# Altium schematic sheet Sheet2.SchDoc
size A4
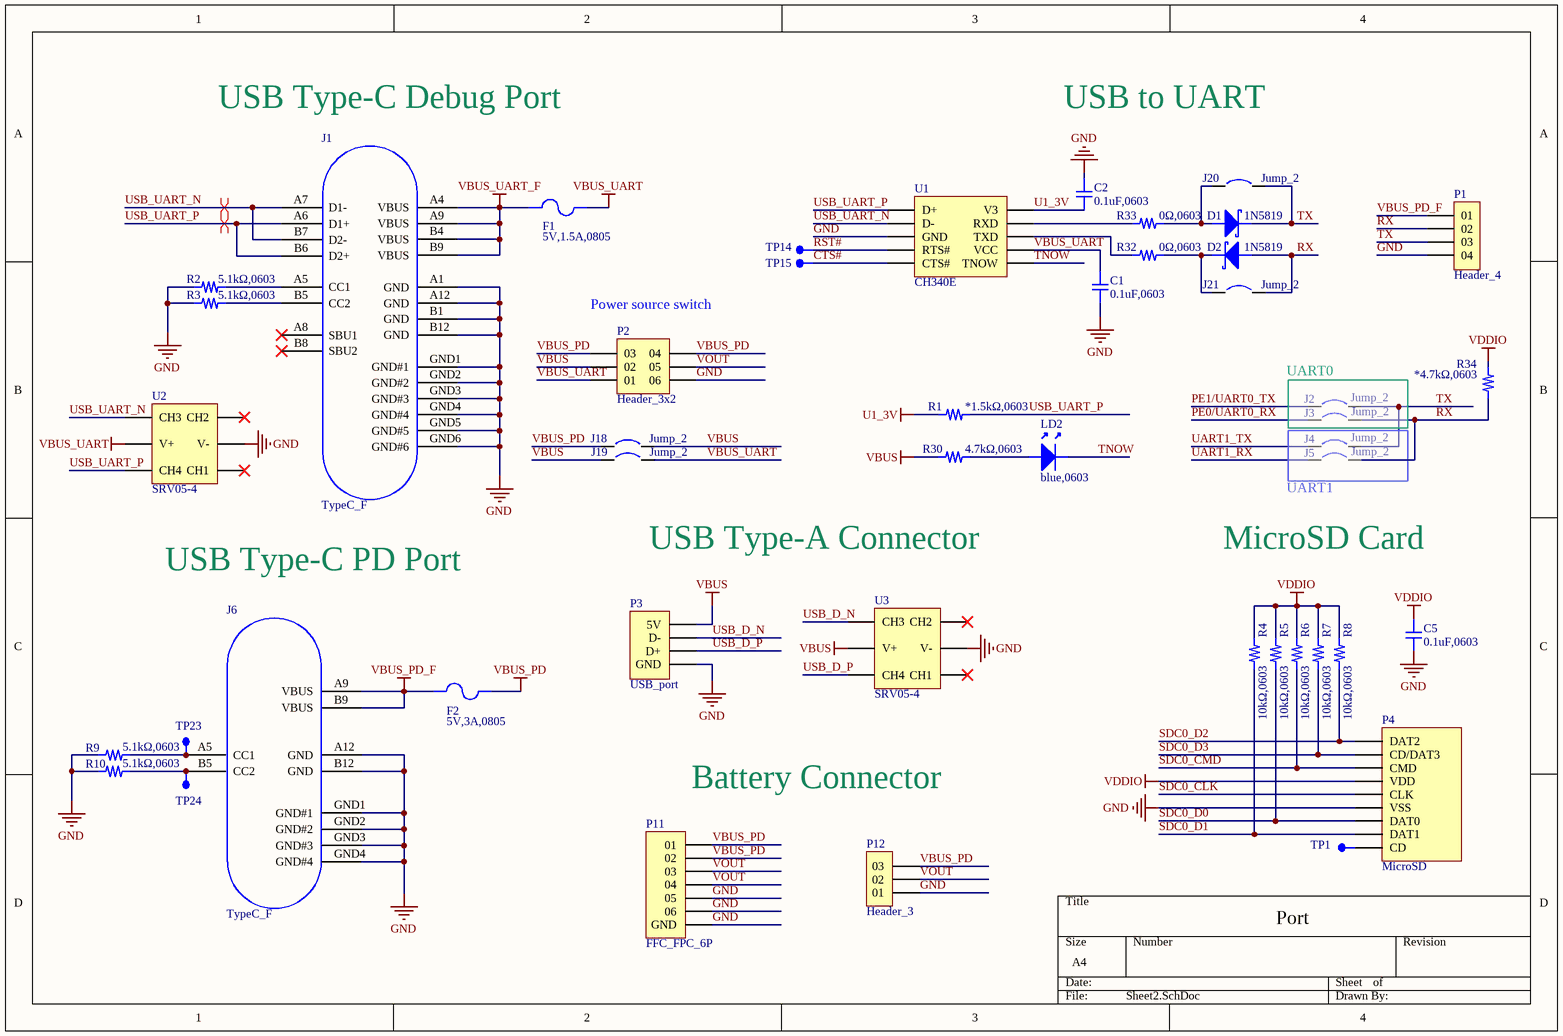
[diagram p0: Sheet2.SchDoc]

## Parts
C1  0.1uF,0603  [C0603]
C2  0.1uF,0603  [C0603]
C5  0.1uF,0603  [C0603]
D1  1N5819  [SOD-323]
D2  1N5819  [SOD-323]
F1  5V,1.5A,0805  [F0805]
F2  5V,3A,0805  [F0805]
J1  TypeC_F  [Type-C_16P_F_0.5_BOTH]
J2  Jump_2  [Jp_small]
J3  Jump_2  [Jp_small]
J4  Jump_2  [Jp_small]
J5  Jump_2  [Jp_small]
J6  TypeC_F  [Type-C_6P_F_BOTH]
J18  Jump_2  [Jp_small]
J19  Jump_2  [Jp_small]
J20  Jump_2  [Jp_small]
J21  Jump_2  [Jp_small]
LD2  blue,0603  [LED0603]
P1  Header_4  [Header_4]
P2  Header_3x2  [HEADER_3x2]
P3  USB_port  [USB-A-female-90]
P4  MicroSD  [MicroSD]
P11  FFC_FPC_6P  [FPC_1MM_6P]
P12  Header_3  [HEADER_3_2MM_SMD]
R1  *1.5kΩ,0603  [R0603]
R2  5.1kΩ,0603  [R0603]
R3  5.1kΩ,0603  [R0603]
R4  10kΩ,0603  [R0603]
R5  10kΩ,0603  [R0603]
R6  10kΩ,0603  [R0603]
R7  10kΩ,0603  [R0603]
R8  10kΩ,0603  [R0603]
R9  5.1kΩ,0603  [R0603]
R10  5.1kΩ,0603  [R0603]
R30  4.7kΩ,0603  [R0603]
R32  0Ω,0603  [R0603]
R33  0Ω,0603  [R0603]
R34  *4.7kΩ,0603  [R0603]
TP1  TP  [TP]  (value not drawn)
TP14  TP  [TP]  (value not drawn)
TP15  TP  [TP]  (value not drawn)
TP23  TP  [TP]  (value not drawn)
TP24  TP  [TP]  (value not drawn)
U1  CH340E  [MSOP-10]
U2  SRV05-4  [SOT23-6]
U3  SRV05-4  [SOT23-6]

## Blocks framed on the sheet
UART0: J2 J3

## Nets
GND: C1.02 C2.01 C5.01 J1.A1(GND) J1.A12(GND) J1.B1(GND) J1.B12(GND) J1.GND1(GND#1) J1.GND2(GND#2) J1.GND3(GND#3) J1.GND4(GND#4) J1.GND5(GND#5) J1.GND6(GND#6) J6.A12(GND) J6.B12(GND) J6.GND1(GND#1) J6.GND2(GND#2) J6.GND3(GND#3) J6.GND4(GND#4) P1.04 P2.06 P3.01(GND) P4.06(VSS) P11.0(GND) P11.05 P11.06 P12.01 R2.01 R3.01 R9.01 R10.01 U1.03(GND) U2.02(V-) U3.02(V-)
U1_3V: C2.02 R1.02 U1.10(V3)
VBUS: J18.02 J19.01 P2.02 P3.04(5V) R30.01 U3.05(V+)
VBUS_PD: F2.02 J18.01 P2.03 P2.04 P11.01 P11.02 P12.03
VBUS_PD_F: F2.01 J6.A9(VBUS) J6.B9(VBUS) P1.01
VBUS_UART: C1.01 F1.02 J19.02 P2.01 U1.07(VCC) U2.05(V+)
VBUS_UART_F: F1.01 J1.A4(VBUS) J1.A9(VBUS) J1.B4(VBUS) J1.B9(VBUS)
VDDIO: C5.02 P4.04(VDD) R4.01 R5.01 R6.01 R7.01 R8.01 R34.02
CTS#: TP15.01 U1.05(CTS#)
PE0/UART0_RX: J3.01
PE1/UART0_TX: J2.01
RST#: TP14.01 U1.04(RTS#)
RX: D2.01 J3.02 J5.02 J21.02 P1.02 R34.01
SDC0_CLK: P4.05(CLK)
SDC0_CMD: P4.03(CMD) R6.02
SDC0_D0: P4.07(DAT0) R5.02
SDC0_D1: P4.08(DAT1) R4.02
SDC0_D2: P4.01(DAT2) R8.02
SDC0_D3: P4.02(CD/DAT3) R7.02
TNOW: LD2.02 U1.06(TNOW)
TX: D1.02 J2.02 J4.02 J20.02 P1.03
UART1_RX: J5.01
UART1_TX: J4.01
USB_D_N: P3.03(D-) U3.04(CH3)
USB_D_P: P3.02(D+) U3.06(CH4)
USB_UART_N: J1.A7(D1-) J1.B7(D2-) U1.02(D-) U2.04(CH3)
USB_UART_P: J1.A6(D1+) J1.B6(D2+) R1.01 U1.01(D+) U2.06(CH4)
VOUT: P2.05 P11.03 P11.04 P12.02
NetD1_01: D1.01 J20.01 R33.02
NetD2_02: D2.02 J21.01 R32.02
NetJ1_A5: J1.A5(CC1) R2.02
NetJ1_B5: J1.B5(CC2) R3.02
NetJ6_A5: J6.A5(CC1) R9.02 TP23.01
NetJ6_B5: J6.B5(CC2) R10.02 TP24.01
NetLD2_01: LD2.01 R30.02
NetP4_09: P4.09(CD) TP1.01
NetR32_01: R32.01 U1.08(TXD)
NetR33_01: R33.01 U1.09(RXD)

Not connected (* = marked no-connect by the designer): J1 A8(SBU1)* B8(SBU2)*; U2 01(CH1)* 03(CH2)*; U3 01(CH1)* 03(CH2)*

## Layout directives
differential pair: USB_UART_N, USB_UART_P

## Notes on the sheet
- USB Type-C Debug Port
- USB to UART
- (near P2) Power source switch
- UART1
- USB Type-C PD Port
- USB Type-A Connector
- MicroSD Card
- Battery Connector
- Port

## Library data of the parts
C1 C2 C5 = Cap
D1 D2 = Diode - Schottky
F1 F2 = Fuse
J1 = Type-C_16P_F_0.5: Female SMD Connector
J6 = Type-C_6P_F_0.5: Female SMD Connector
LD2 = Diode - LED
R1-R10 R30 R32-R34 = Res